# EasyEDA Pro project Smart-ePaper-TestBoard.eprj

# Schematic Schematic1
Board Name: Board1; Create Date: 2024-09-18; Company: TLLWTG; Drawed: TLLWTG; Reviewed: TLLWTG
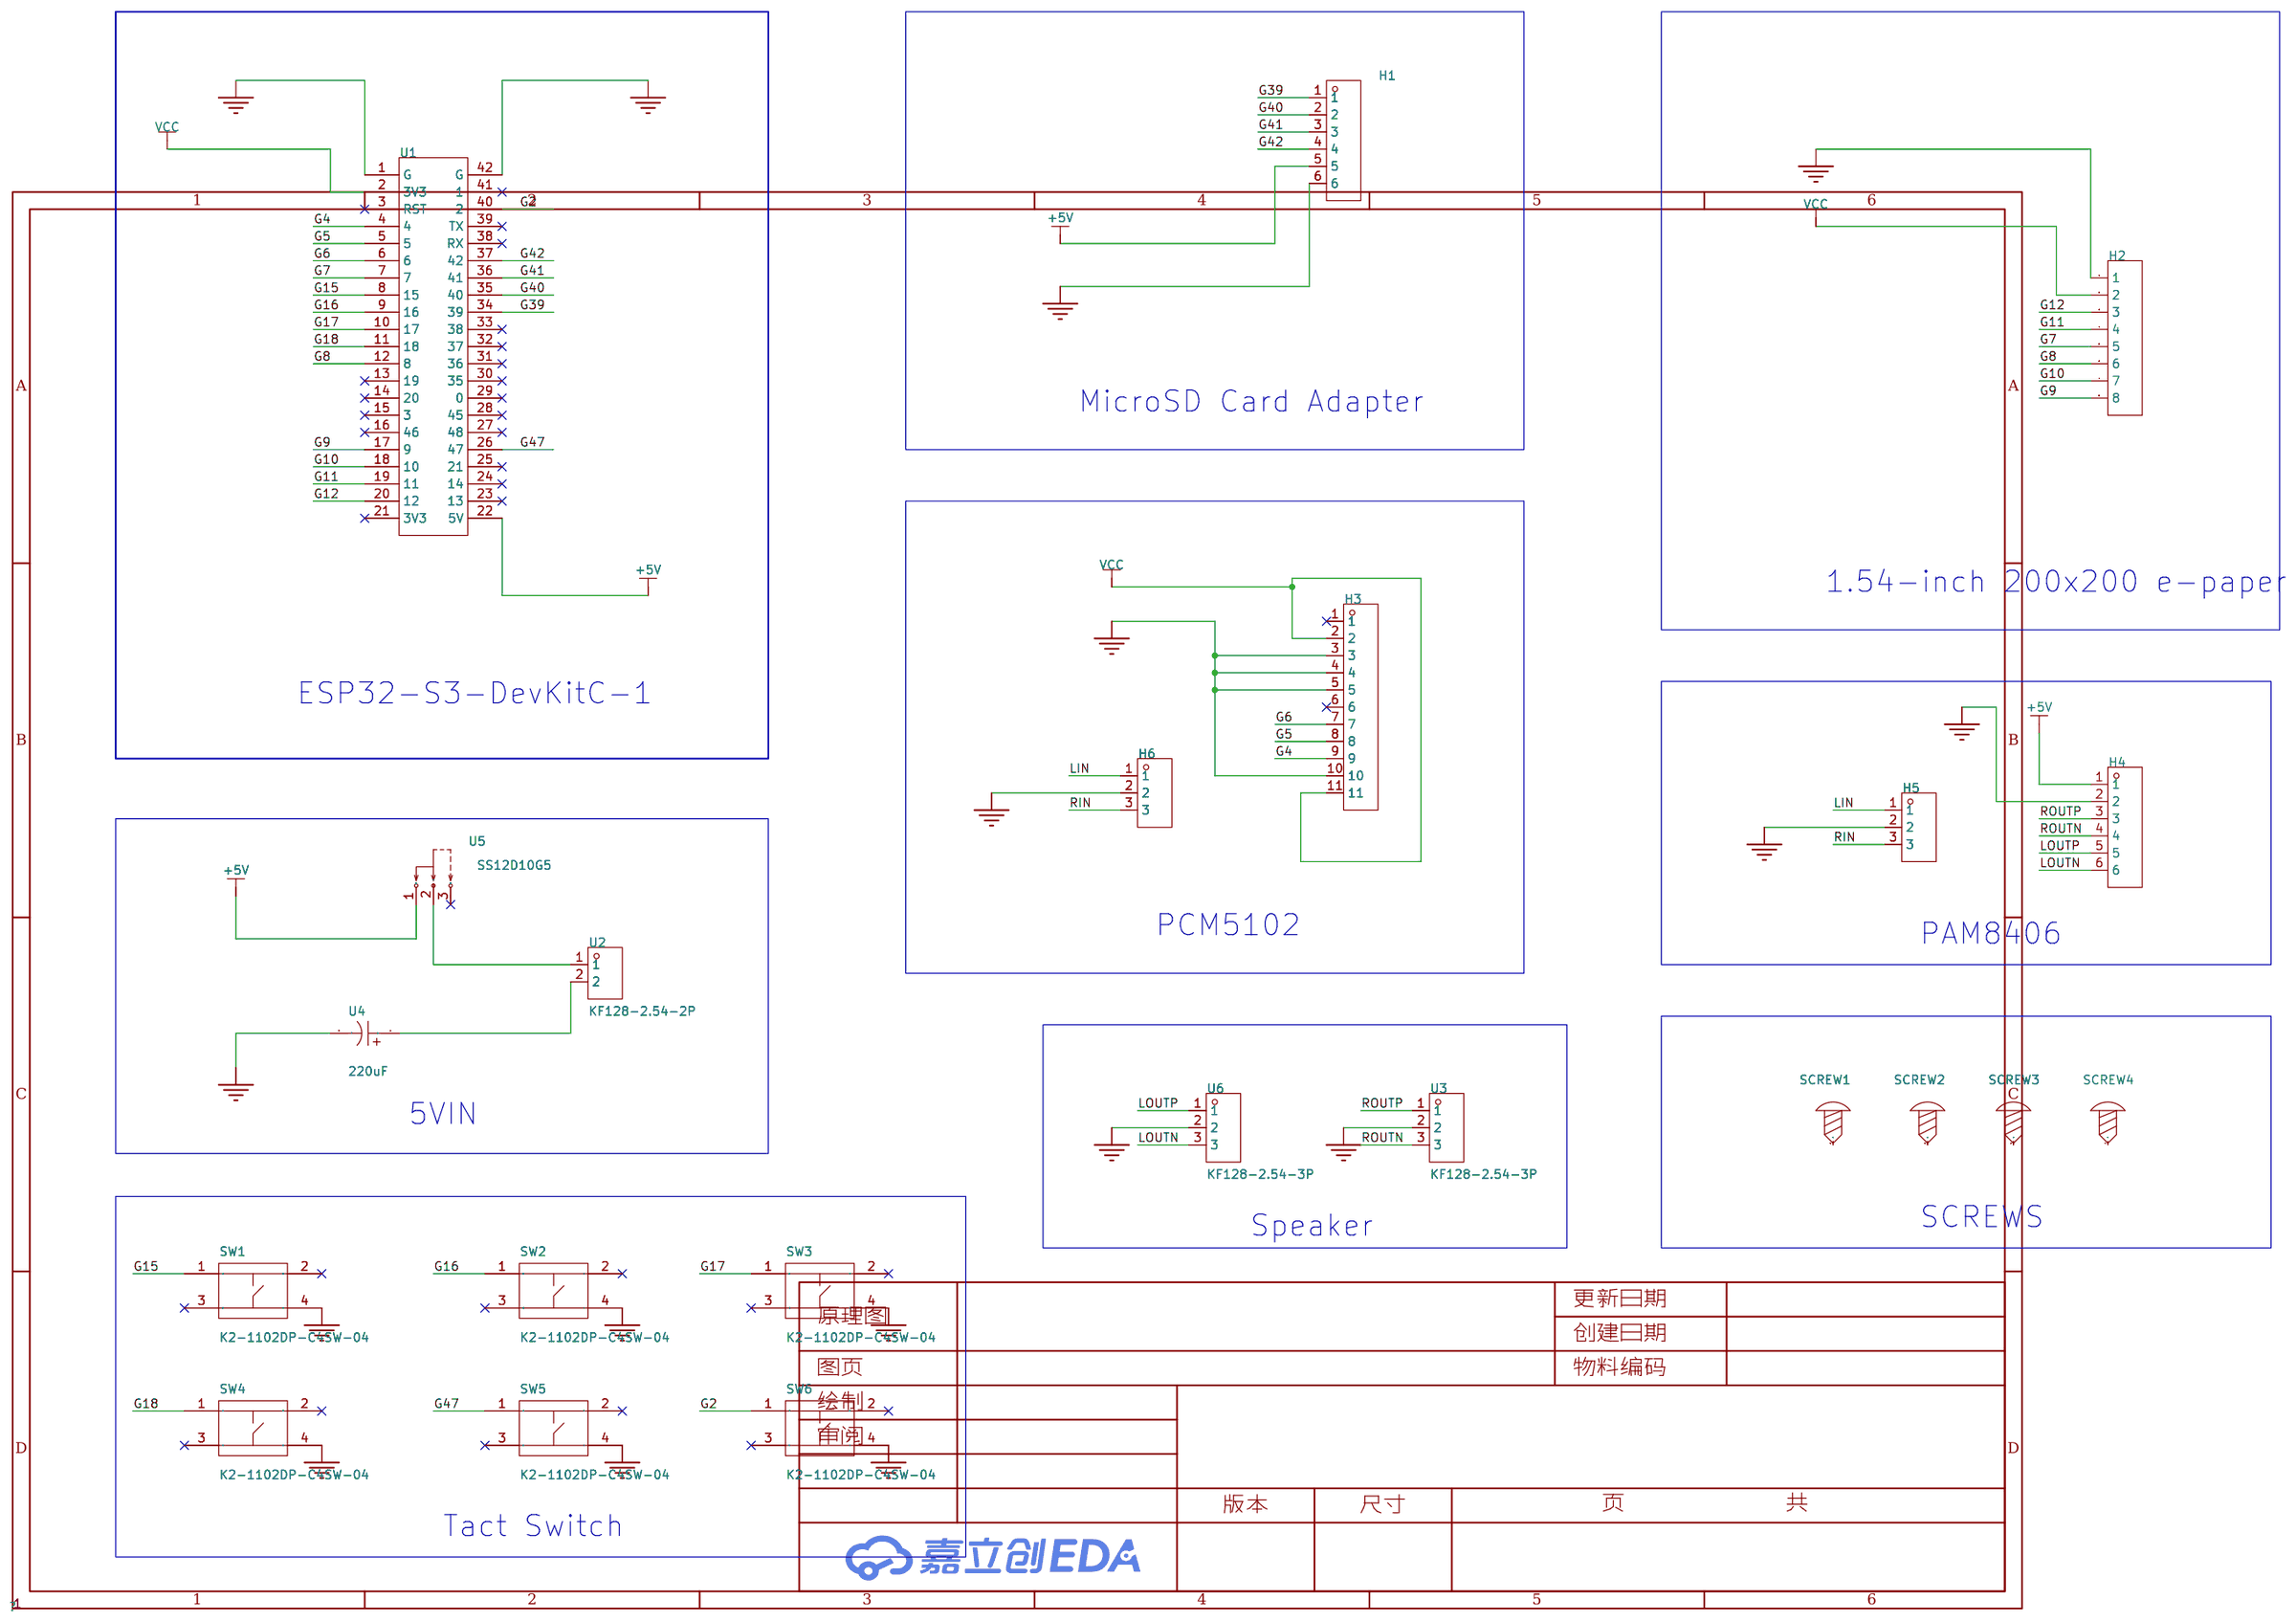
[diagram p0: schematic sheet]

## Parts
H1  -  [HDR-TH_6P-P2.54-V-F]
H2  -  [HDR-TH_8P-P2.54-V-F-1]
H3  -  [HDR-TH_11P-P2.54-V-F]
H4  -  [HDR-TH_6P-P2.54-V-F]
H5  -  [HDR-TH_3P-P2.54-V-F]
H6  -  [HDR-TH_3P-P2.54-V-F]
SCREW1  -  [M3螺丝]
SCREW2  -  [M3螺丝]
SCREW3  -  [M3螺丝]
SCREW4  -  [M3螺丝]
SW1  K2-1102DP-C4SW-04  [KEY-TH_4P-L6.0-W6.0-P4.50-LS6.50]
SW2  K2-1102DP-C4SW-04  [KEY-TH_4P-L6.0-W6.0-P4.50-LS6.50]
SW3  K2-1102DP-C4SW-04  [KEY-TH_4P-L6.0-W6.0-P4.50-LS6.50]
SW4  K2-1102DP-C4SW-04  [KEY-TH_4P-L6.0-W6.0-P4.50-LS6.50]
SW5  K2-1102DP-C4SW-04  [KEY-TH_4P-L6.0-W6.0-P4.50-LS6.50]
SW6  K2-1102DP-C4SW-04  [KEY-TH_4P-L6.0-W6.0-P4.50-LS6.50]
U1  -  [ESP32-S3-DevKitC-1]
U2  KF128-2.54-2P  [CONN-TH_P2.54_KF128-2.54-2P]
U3  KF128-2.54-3P  [CONN-TH_3P-P2.54_KF128-2.54-3P]
U4  220uF  [CAP-TH_BD6.3-P2.50-D0.5-FD]
U5  SS12D10G5  [SW-TH_SHOU-HAN_SS12D10G4]
U6  KF128-2.54-3P  [CONN-TH_3P-P2.54_KF128-2.54-3P]

## Library data of the parts
H1 H4 = HDR-F_2.54_1x6P: Supplier Part: C40877; Supplier Footprint: 插件
H2 = HDR-F_2.54_1x8P: Supplier Part: C27438; Supplier Footprint: 插件
H3 = HDR-F_2.54_1x11P: Supplier Part: C2897374; Supplier Footprint: 插件
H5 H6 = HDR-F_2.54_1x3P: Supplier Part: C541850; Supplier Footprint: 插件
SCREW1-SCREW4 = M3螺丝: Supplier Footprint: 插件
SW1-SW6 = K2-1102DP-C4SW-04: LCSC Part Name: 轻触按键开关6*6*5; Supplier Part: C110153; Manufacturer: 韩国韩荣; Supplier Footprint: 插件; JLCPCB Part Class: 扩展库; Datasheet: https://atta.szlcsc.com/upload/public/pdf/source/20210810/D0CD9D77408EACA829A5E533AC6E5B1E.pdf; Supplier: LCSC; Circuit: 单刀单掷; Actuator Style: 圆形按钮; Operating Force: 2.5N; Mounting Style: 直插; Switch Length: 6mm; Switch Width: 6mm; Switch Height: 5mm; Contact Current: 50mA; Voltage Rating (DC): 12V; Insulation Resistance: 100MΩ; Mechanical Life: 10万次; Operating Temperature: -25℃~+85℃
U1 = ESP32-S3-DevKitC-1
U2 = KF128-2.54-2P: LCSC Part Name: 2.54mm 1x2P 排数:1 每排P数:2 直插; Supplier Part: C474920; Manufacturer: KEFA(科发); Supplier Footprint: 插件,P=2.54mm; JLCPCB Part Class: 扩展库; Datasheet: https://atta.szlcsc.com/upload/public/pdf/source/20230317/0E5ECA9DB49110BC3219D12632CEA6EE.pdf; Supplier: LCSC; Structure: 1x2P; Pitch: 2.54mm; Color: 绿色; Mounting Style: 直插; Current Rating (Max): 8A; Voltage Rating (Max): 130V; Number of Pins: 2P; Number of Rows: 1; Wire Gauge - AWG: 18~26; Wire Gauge - mm2: 1; Number of PINs Per Row: 2; Operating Temperature Range: -40℃~+105℃
U3 U6 = KF128-2.54-3P: LCSC Part Name: 2.54mm 1x3P 排数:1 每排P数:3 直插; Supplier Part: C474921; Manufacturer: KEFA(科发); Supplier Footprint: 插件,P=2.54mm; JLCPCB Part Class: 扩展库; Datasheet: https://atta.szlcsc.com/upload/public/pdf/source/20230317/0E5ECA9DB49110BC3219D12632CEA6EE.pdf; Supplier: LCSC; Structure: 1x3P; Pitch: 2.54mm; Color: 绿色; Mounting Style: 直插; Current Rating (Max): 8A; Voltage Rating (Max): 130V; Number of Pins: 3P; Number of Rows: 1; Wire Gauge - AWG: 18~26; Wire Gauge - mm2: 1; Number of PINs Per Row: 3; Operating Temperature Range: -40℃~+105℃
U4 = KM1E221M0611: LCSC Part Name: 220uF ±20% 25V; Supplier Part: C2873972; Manufacturer: ROQANG(容强); Supplier Footprint: 插件; JLCPCB Part Class: 扩展库; Datasheet: https://atta.szlcsc.com/upload/public/pdf/source/20210825/43CC5C3A3C9845108B639C21E16A1224.pdf; Supplier: LCSC; Tolerance: ±20%; Rated Voltage: 25V; Ripple Current: 236mA@120kHz; Lead Spacing: 2.5mm; Lifetime @ Temp: 2000hrs@105℃; Operating Temperature: -40℃~+105℃
U5 = SS12D10G5: LCSC Part Name: 两档立式插件 3脚拨动开关 柄长5.0mm; Supplier Part: C7431054; Manufacturer: SHOU HAN(首韩); Supplier Footprint: 插件; JLCPCB Part Class: 扩展库; Datasheet: https://atta.szlcsc.com/upload/public/pdf/source/20231130/7A3DB6A149BF0A1DCFFE64FFC07FE434.pdf; Supplier: LCSC; Circuit: 单刀双掷; Switch Length: 12.7mm; Switch Width: 6.7mm; Mounting Style: 直插; Current Rating (DC): 2A; Voltage Rating (DC): 125V; Mechanical Life: 3千次; Operating Temperature: -25℃~+70℃

## Nets
+5V: H1.5 H4.1 U1.22(5V) U5.1
GND: H1.6 H2.1 H3.3 H3.4 H3.5 H3.10 H4.2 H5.2 H6.2 SW1.4 SW2.4 SW3.4 SW4.4 SW5.4 SW6.4 U1.1(G) U1.42(G) U3.2 U4.2 U6.2
VCC: H2.2 H3.2 H3.11 U1.2(3V3)
G2: SW6.1 U1.40(2)
G4: H3.9 U1.4
G5: H3.8 U1.5
G6: H3.7 U1.6
G7: H2.5 U1.7
G8: H2.6 U1.12(8)
G9: H2.8 U1.17(9)
G10: H2.7 U1.18(10)
G11: H2.4 U1.19(11)
G12: H2.3 U1.20(12)
G15: SW1.1 U1.8(15)
G16: SW2.1 U1.9(16)
G17: SW3.1 U1.10(17)
G18: SW4.1 U1.11(18)
G39: H1.1 U1.34(39)
G40: H1.2 U1.35(40)
G41: H1.3 U1.36(41)
G42: H1.4 U1.37(42)
G47: SW5.1 U1.26(47)
LIN: H5.1 H6.1
LOUTN: H4.6 U6.3
LOUTP: H4.5 U6.1
RIN: H5.3 H6.3
ROUTN: H4.4 U3.3
ROUTP: H4.3 U3.1
$1N2712: U2.2 U4.1
$1N2746: U2.1 U5.2

Not connected (* = marked no-connect by the designer): H3 1* 6*; SCREW1 1; SCREW2 1; SCREW3 1; SCREW4 1; SW1 2* 3*; SW2 2* 3*; SW3 2* 3*; SW4 2* 3*; SW5 2* 3*; SW6 2* 3*; U1 3(RST)* 13(19)* 14(20)* 15(3)* 16(46)* 21(3V3)* 23(13)* 24(14)* 25(21)* 27(48)* 28(45)* 29(0)* 30(35)* 31(36)* 32(37)* 33(38)* 38(RX)* 39(TX)* 41(1)*; U5 3*

## Notes on the sheet
- MicroSD Card Adapter
- 1.54-inch 200x200 e-paper
- ESP32-S3-DevKitC-1
- PCM5102
- PAM8406
- 5VIN
- SCREWS
- Speaker
- Tact Switch

# Board PCB1
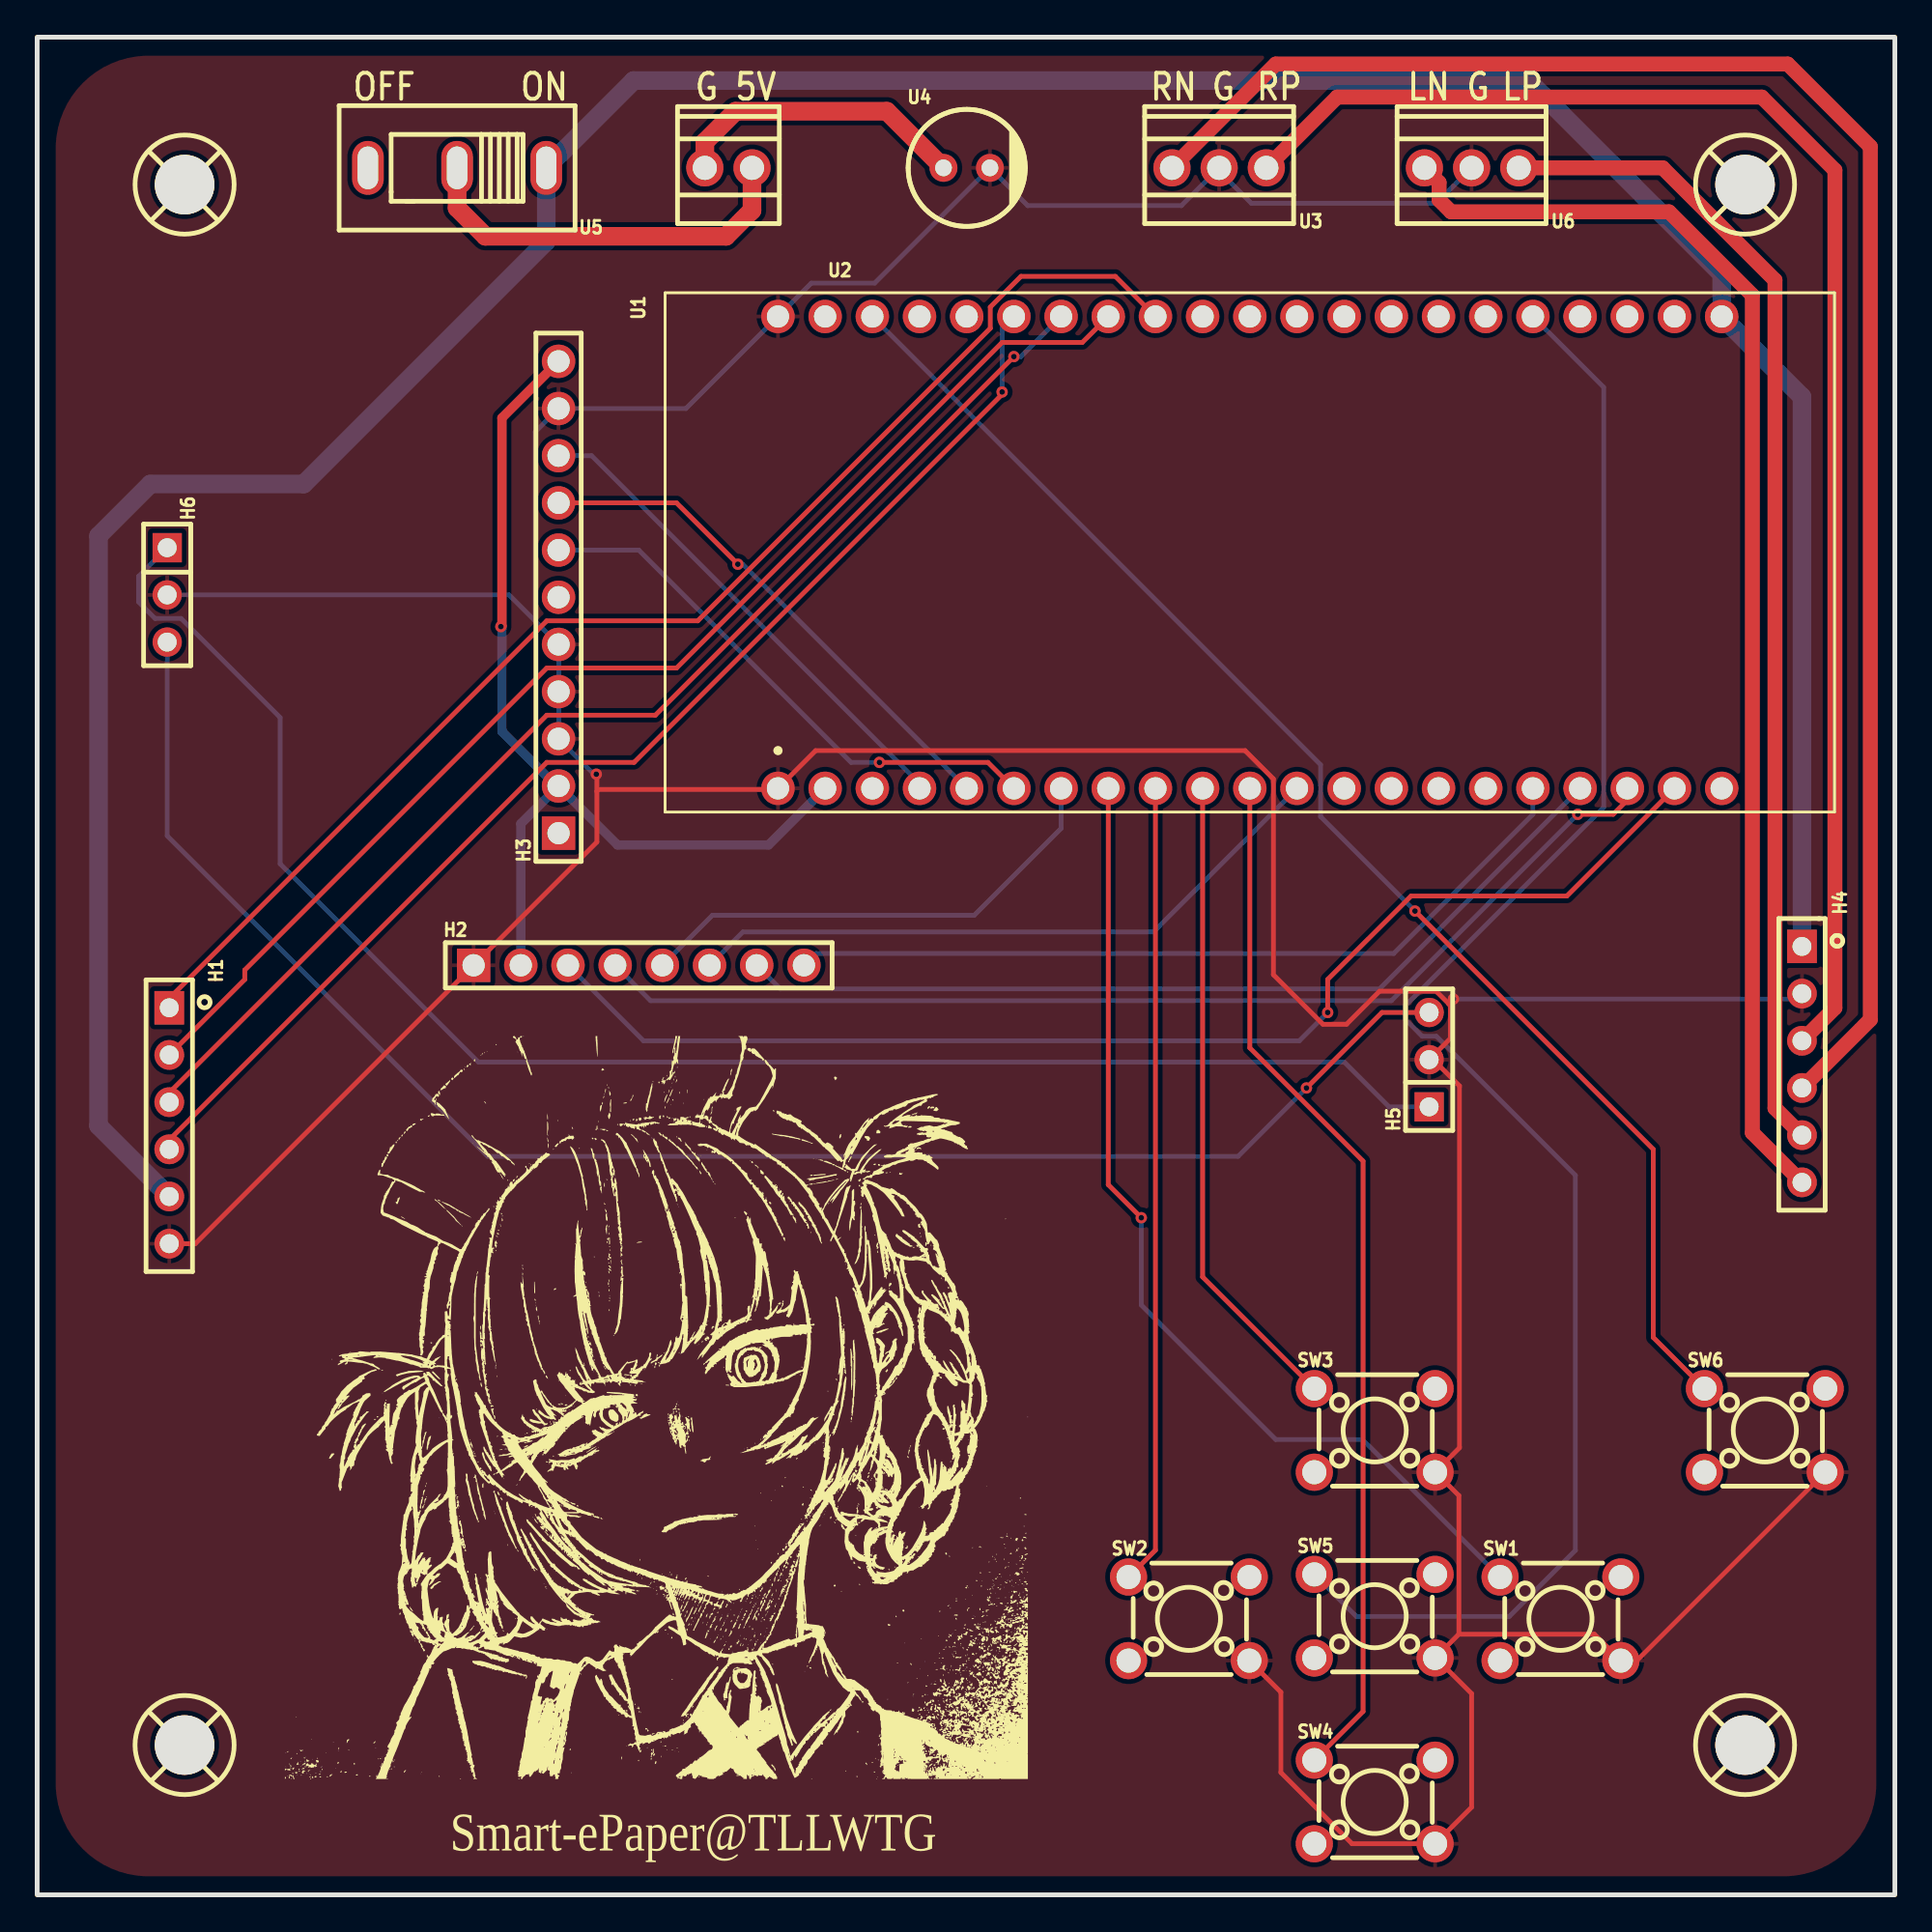
[diagram p1: board, top side]
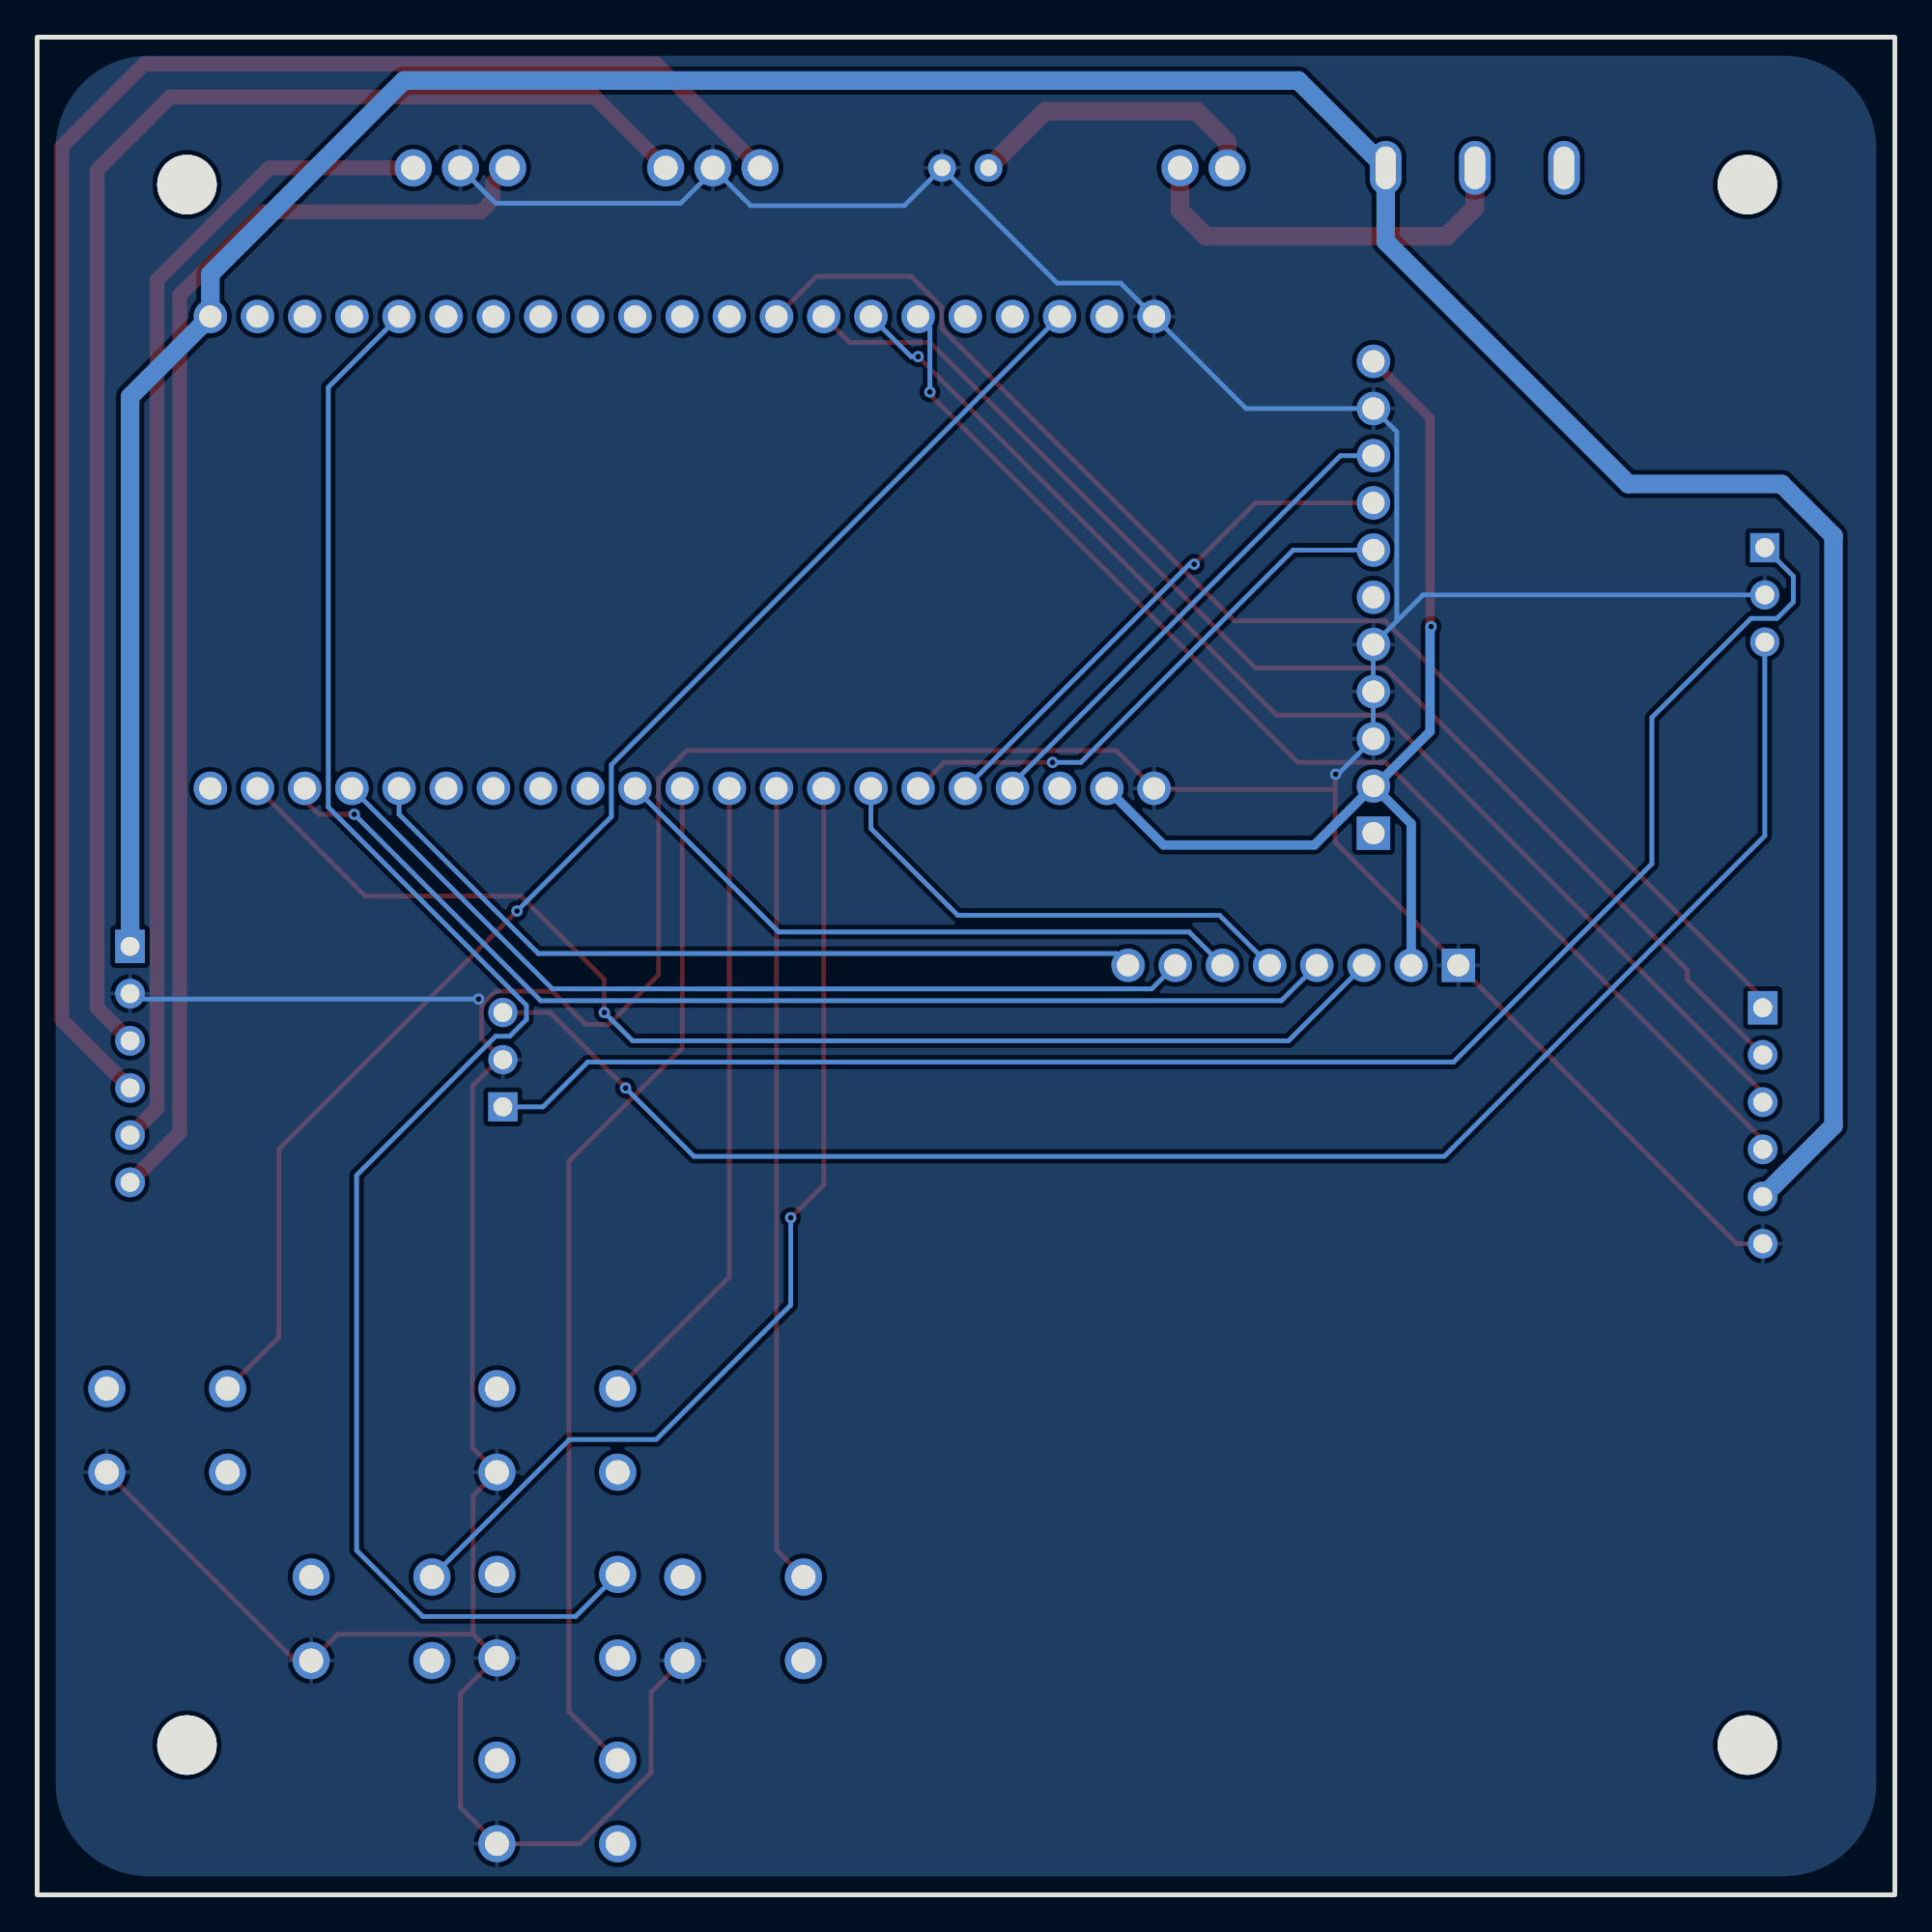
[diagram p2: board, bottom side, seen from below]

Outline 100 x 100 mm; copper layers: Top Layer, Bottom Layer. Coordinates in mm from the lower left corner of the outline.
Outline path: rectangle 0,100 100,0
Stack: Top Layer 0.035mm / Dielectric1 1.51mm FR4 er 4.5 / Bottom Layer 0.035mm

## Design rules (mm)
template: JLCPCB Capability(Two Layers Board)
spacing copperThickness1oz (default): track to track 0.102, other pairs 0.152 to 0.3
spacing copperThickness2oz: track to track 0.203, other pairs 0.152 to 0.3
track width copperThickness1oz (default): min 0.127, default 0.254, max 2.54
track width copperThickness2oz: min 0.203, default 0.254, max 2.54
differential pair differentialPair (default): width min 0.127, default 0.254, max 2.54; gap min 0.152, default 0.152
via viaSize (default): diameter min 0.5, default 0.61, max 10; hole min 0.3, default 0.305, max 6.3

## Placement (name value [footprint] x y rotation side)
H1  -  [HDR-TH_6P-P2.54-V-F]  7.11 41.4 270 top
H2  -  [HDR-TH_8P-P2.54-V-F-1]  32.38 50.04 0 top
H3  -  [HDR-TH_11P-P2.54-V-F]  28.07 69.85 90 top
H4  -  [HDR-TH_6P-P2.54-V-F]  95 44.7 270 top
H5  -  [HDR-TH_3P-P2.54-V-F]  74.93 44.96 90 top
H6  -  [HDR-TH_3P-P2.54-V-F]  7 69.98 270 top
SCREW1  -  [M3螺丝]  8 92 0 top
SCREW2  -  [M3螺丝]  92 92 0 top
SCREW3  -  [M3螺丝]  92 8 0 top
SCREW4  -  [M3螺丝]  8 8 0 top
SW1  K2-1102DP-C4SW-04  [KEY-TH_4P-L6.0-W6.0-P4.50-LS6.50]  82 14.86 0 top
SW2  K2-1102DP-C4SW-04  [KEY-TH_4P-L6.0-W6.0-P4.50-LS6.50]  62 14.86 0 top
SW3  K2-1102DP-C4SW-04  [KEY-TH_4P-L6.0-W6.0-P4.50-LS6.50]  72 25 0 top
SW4  K2-1102DP-C4SW-04  [KEY-TH_4P-L6.0-W6.0-P4.50-LS6.50]  72 5 0 top
SW5  K2-1102DP-C4SW-04  [KEY-TH_4P-L6.0-W6.0-P4.50-LS6.50]  72 15 0 top
SW6  K2-1102DP-C4SW-04  [KEY-TH_4P-L6.0-W6.0-P4.50-LS6.50]  93 25 0 top
U1  -  [ESP32-S3-DevKitC-1]  65.28 72.26 90 top
U2  KF128-2.54-2P  [CONN-TH_P2.54_KF128-2.54-2P]  37.21 92.96 180 top
U3  KF128-2.54-3P  [CONN-TH_3P-P2.54_KF128-2.54-3P]  63.63 92.96 180 top
U4  220uF  [CAP-TH_BD6.3-P2.50-D0.5-FD]  50.04 92.96 0 top
U5  SS12D10G5  [SW-TH_SHOU-HAN_SS12D10G4]  22.61 92.96 180 top
U6  KF128-2.54-3P  [CONN-TH_3P-P2.54_KF128-2.54-3P]  77.22 92.96 180 top

## Footprints (pads in the part's own frame, mm; a bottom-side part is the same pattern mirrored in y, then rotated)
CAP-TH_BD6.3-P2.50-D0.5-FD
  round 1.5 hole 0.9: 1(-1.25,0) 2(1.25,0)
CONN-TH_3P-P2.54_KF128-2.54-3P
  round 2 hole 1.3: 1(-2.54,0) 2(0,0) 3(2.54,0)
CONN-TH_P2.54_KF128-2.54-2P
  round 2 hole 1.3: 1(-1.27,0) 2(1.27,0)
ESP32-S3-DevKitC-1
  round 1.8 hole 1.2: 1(-12.7,25.4) 2(-12.7,22.86) 3(-12.7,20.32) 4(-12.7,17.78) 5(-12.7,15.24) 6(-12.7,12.7) 7(-12.7,10.16) 8(-12.7,7.62) 9(-12.7,5.08) 10(-12.7,2.54) 11(-12.7,0) 12(-12.7,-2.54) 13(-12.7,-5.08) 14(-12.7,-7.62) 15(-12.7,-10.16) 16(-12.7,-12.7) 17(-12.7,-15.24) 18(-12.7,-17.78) 19(-12.7,-20.32) 20(-12.7,-22.86) 21(-12.7,-25.4) 22(12.7,-25.4) 23(12.7,-22.86) 24(12.7,-20.32) 25(12.7,-17.78) 26(12.7,-15.24) 27(12.7,-12.7) 28(12.7,-10.16) 29(12.7,-7.62) 30(12.7,-5.08) 31(12.7,-2.54) 32(12.7,0) 33(12.7,2.54) 34(12.7,5.08) 35(12.7,7.62) 36(12.7,10.16) 37(12.7,12.7) 38(12.7,15.24) 39(12.7,17.78) 40(12.7,20.32) 41(12.7,22.86) 42(12.7,25.4)
HDR-TH_3P-P2.54-V-F
  rect 1.575x1.575 hole 1.02: 1(-2.54,0)
  round 1.575 hole 1.02: 2(0,0) 3(2.54,0)
HDR-TH_6P-P2.54-V-F
  rect 1.8x1.6 hole 1.02: 1(-6.35,0)
  round 1.6 hole 1.02: 2(-3.81,0) 3(-1.27,0) 4(1.27,0) 5(3.81,0) 6(6.35,0)
HDR-TH_8P-P2.54-V-F-1
  rect 1.8x1.8 hole 1.2: 1(-8.89,0)
  round 1.8 hole 1.2: 2(-6.35,0) 3(-3.81,0) 4(-1.27,0) 5(1.27,0) 6(3.81,0) 7(6.35,0) 8(8.89,0)
HDR-TH_11P-P2.54-V-F
  rect 1.8x1.8 hole 1.2: 1(-12.7,0)
  round 1.8 hole 1.2: 2(-10.16,0) 3(-7.62,0) 4(-5.08,0) 5(-2.54,0) 6(0,0) 7(2.54,0) 8(5.08,0) 9(7.62,0) 10(10.16,0) 11(12.7,0)
KEY-TH_4P-L6.0-W6.0-P4.50-LS6.50
  round 2 hole 1.3: 1(-3.25,2.25) 2(3.25,2.25) 3(-3.25,-2.25) 4(3.25,-2.25)
M3螺丝
  round 3.2 hole 3.2: 1(-0.064,0.064)
SW-TH_SHOU-HAN_SS12D10G4
  oval 1.7x2.9 hole 1.1x2.3: 1(-4.8,0) 2(0,0) 3(4.8,0)

## Nets
As in the schematic.

Pads without a net: H3 1 6; SCREW1 1; SCREW2 1; SCREW3 1; SCREW4 1; SW1 2 3; SW2 2 3; SW3 2 3; SW4 2 3; SW5 2 3; SW6 2 3; U1 3 13 14 15 16 21 23 24 25 27 28 29 30 31 32 33 38 39 41; U5 3

## Via types
v1: diameter 0.61, hole 0.305, Top Layer to Bottom Layer, 12 vias

## Routing (per net, layer and track width the routed paths; a pad name or vN(x,y) marks a point on that pad's centre or on a via; arc(x,y) is an arc through that point)
+5V: length 179.3
  Bottom Layer w1: H4.1 95,80.64 U1.22 90.68,87.25 80.26,97.66 32.1,97.66 U5.1 27.41,89 14.35,75.95 6.1,75.95 3.3,73.15 3.3,41.4 H1.5
GND: length 305.7
  Top Layer w0.254: 76.53,14.03 75.28,12.78 ; 76.53,14.03 76.53,21.49 75.26,22.76 ; 76.53,14.03 83.83,14.03 SW1.4 86.11,12.61 SW6.4 ; 75.28,12.78 SW5.4 ; 75.28,12.78 77.22,10.83 77.22,4.72 SW4.4 70.78,2.75 66.95,6.58 66.95,10.91 SW2.4 ; v1(30.1,60.33) 30.13,60.29 30.13,59.4 ; 75.04,45.07 76.56,43.54 76.56,24.06 75.26,22.76 ; 75.04,45.07 76.07,46.1 76.07,47.88 75.98,47.97 ; 75.04,45.07 H5.2 ; 75.98,47.97 v1(76.24,48.22) ; 75.98,47.97 75.31,48.64 72.26,48.64 70.49,46.86 69.22,46.86 66.55,49.53 66.55,60.07 65.02,61.59 41.91,61.59 U1.1 39.81,59.5 30.23,59.5 30.13,59.4 ; 75.26,22.76 SW3.4 ; 30.13,59.4 30.13,56.67 8.51,35.05 H1.6
  Bottom Layer w0.254: 26.81,68.57 H3.5 28.08,67.3 28.08,64.76 ; 26.81,68.57 25.4,69.98 H6.2 ; 26.81,68.57 26.81,78.75 H3.10 34.93,80.01 U1.42 41.67,86.76 45.08,86.76 U4.2 53.32,90.93 61.59,90.93 63.54,92.88 ; 28.08,64.76 H3.4 ; 28.08,64.76 28.08,62.22 ; v1(76.24,48.22) 94.71,48.22 H4.2 ; 63.54,92.88 65.36,91.06 75.31,91.06 U6.2 ; 63.54,92.88 U3.2 ; 28.08,62.22 29.97,60.33 v1(30.1,60.33) ; 28.08,62.22 H3.3
VCC: length 52.9
  Top Layer w0.5: v1(24.96,68.27) 25.02,68.33 25.02,79.5 H3.11
  Bottom Layer w0.254: 28.01,59.63 H3.2 ; 42.37,59.51 U1.2
  Bottom Layer w0.5: v1(24.96,68.27) 25.02,68.21 25.02,62.63 28.01,59.63 26.03,57.66 H2.2 ; 42.37,59.51 39.37,56.52 31.24,56.52 H3.2
G2: length 76.3
  Top Layer w0.254: SW6.1 87,30 87,40.13 v1(74.17,52.96)
  Bottom Layer w0.254: v1(74.17,52.96) 69.09,58.04 69.09,60.83 U1.40
G4: length 27
  Bottom Layer w0.254: H3.9 29.84,77.47 47.5,59.82 U1.4
G5: length 28.3
  Top Layer w0.254: v1(37.72,71.63) 34.42,74.93 H3.8
  Bottom Layer w0.254: v1(37.72,71.63) 37.97,71.63 U1.5
G6: length 29.8
  Top Layer w0.254: v1(45.34,60.96) 51.18,60.96 U1.6
  Bottom Layer w0.254: H3.7 32.38,72.39 43.81,60.96 v1(45.34,60.96)
G7: length 26.7
  Bottom Layer w0.254: U1.7 55.12,57.4 50.45,52.73 36.35,52.73 H2.5
G8: length 35.6
  Bottom Layer w0.254: H2.6 37.99,51.83 60.09,51.83 U1.12
G9: length 44
  Bottom Layer w0.254: U1.17 80.52,58.17 73.03,50.67 41.91,50.67 41.28,50.04
G10: length 49.3
  Bottom Layer w0.254: 38.74,50.04 40,48.77 72.26,48.77 U1.18
G11: length 60.4
  Top Layer w0.254: v1(82.93,58.17) 84.84,58.17 85.6,58.93 U1.19
  Bottom Layer w0.254: 31.12,50.04 33.02,48.13 72.9,48.13 v1(82.93,58.17)
G12: length 67.9
  Top Layer w0.254: U1.20 82.34,53.77 73.96,53.77 69.47,49.28 v1(69.47,47.5)
  Bottom Layer w0.254: H2.3 32.64,45.97 67.94,45.97 v1(69.47,47.5)
G15: length 53.9
  Top Layer w0.254: U1.8 57.66,38.23 v1(59.44,36.45)
  Bottom Layer w0.254: SW1.1 71.35,24.51 66.68,24.51 59.44,31.75 v1(59.44,36.45)
G16: length 43.1
  Top Layer w0.254: U1.9 60.2,18.56 SW2.1
G17: length 34.8
  Top Layer w0.254: SW3.1 62.74,33.26 U1.10
G18: length 55.9
  Top Layer w0.254: U1.11 65.28,45.59 71.37,39.5 71.37,9.87 SW4.1
G39: length 71.3
  Top Layer w0.254: U1.34 58.04,87.12 52.96,87.12 51.31,85.47 51.31,84.33 35.56,68.58 27.43,68.58 7.11,48.26 H1.1
G40: length 67.3
  Top Layer w0.254: U1.35 56.26,83.57 51.94,83.57 34.42,66.04 27.43,66.04 11.18,49.78 11.18,49.28 H1.2
G41: length 65.8
  Top Layer w0.254: v1(52.58,82.8) 33.27,63.5 27.43,63.5 7.11,43.18 H1.3
  Bottom Layer w0.254: U1.36 52.96,82.8 v1(52.58,82.8)
G42: length 66.4
  Top Layer w0.254: H1.4 7.11,40.64 27.43,60.96 32.13,60.96 51.94,80.77 v1(51.94,80.9)
  Bottom Layer w0.254: U1.37 51.94,84.33 v1(51.94,80.9)
G47: length 93.1
  Bottom Layer w0.254: SW5.1 71.01,14.99 79.25,14.99 82.8,18.54 82.8,38.73 75.32,46.22 74.56,46.22 73.66,47.12 73.66,47.88 84.33,58.55 84.33,81.15 U1.26
LIN: length 88.9
  Bottom Layer w0.254: H5.1 72.77,42.42 70.36,44.83 23.75,44.83 13.08,55.5 13.08,63.37 7.75,68.71 6.35,68.71 5.46,69.6 5.46,70.98 7,72.52
LOUTN: length 69.9
  Top Layer w0.8: H4.6 92.33,41.03 92.33,86.11 87.84,90.6 76.11,90.6 75.47,91.25 75.47,92.17 U6.3
LOUTP: length 62.9
  Top Layer w0.8: U6.1 87.5,92.96 93.55,86.92 93.55,42.35 H4.5
RIN: length 88.7
  Top Layer w0.254: v1(68.33,43.43) 72.39,47.5 H5.3
  Bottom Layer w0.254: H6.3 7,57.01 24.26,39.75 64.64,39.75 v1(68.33,43.43)
ROUTN: length 93.9
  Top Layer w0.8: H4.4 98.68,47.11 98.68,94.11 94.23,98.55 66.68,98.55 U3.3
ROUTP: length 81.4
  Top Layer w0.8: H4.3 96.77,47.75 96.77,92.84 92.84,96.77 69.98,96.77 U3.1
$1N2712: length 16.2
  Top Layer w1: U4.1 45.74,96.01 37.59,96.01 35.94,94.36 U2.2
$1N2746: length 21.5
  Top Layer w1: 38.48,92.96 38.48,90.68 37.08,89.28 24.13,89.28 22.61,90.81 U5.2

## Copper pours and planes (outline as drawn; the poured copper is in the pictures)
GND on Top Layer: 1,94 1.01,94.34 1.06,94.78 1.15,95.22 1.28,95.65 1.45,96.07 1.65,96.47 1.89,96.85 2.16,97.2 2.46,97.54 2.8,97.84 3.15,98.11 3.53,98.35 3.93,98.55 4.35,98.72 4.78,98.85 5.22,98.94 5.66,98.99 6,99 94,99 94.34,98.99 94.78,98.94 95.22,98.85 95.65,98.72 96.07,98.55 96.47,98.35 96.85,98.11 97.2,97.84 97.54,97.54 97.84,97.2 98.11,96.85 98.35,96.47 98.55,96.07 98.72,95.65 98.85,95.22 98.94,94.78 98.99,94.34 99,94 99,6 98.99,5.66 98.94,5.22 98.85,4.78 98.72,4.35 98.55,3.93 98.35,3.53 98.11,3.15 97.84,2.8 97.54,2.46 97.2,2.16 96.85,1.89 96.47,1.65 96.07,1.45 95.65,1.28 95.22,1.15 94.78,1.06 94.34,1.01 94,1 6,1 5.66,1.01 5.22,1.06 4.78,1.15 4.35,1.28 3.93,1.45 3.53,1.65 3.15,1.89 2.8,2.16 2.46,2.46 2.16,2.8 1.89,3.15 1.65,3.53 1.45,3.93 1.28,4.35 1.15,4.78 1.06,5.22 1.01,5.66 1,6
GND on Bottom Layer: 1,94 1.01,94.34 1.06,94.78 1.15,95.22 1.28,95.65 1.45,96.07 1.65,96.47 1.89,96.85 2.16,97.2 2.46,97.54 2.8,97.84 3.15,98.11 3.53,98.35 3.93,98.55 4.35,98.72 4.78,98.85 5.22,98.94 5.66,98.99 6,99 94,99 94.34,98.99 94.78,98.94 95.22,98.85 95.65,98.72 96.07,98.55 96.47,98.35 96.85,98.11 97.2,97.84 97.54,97.54 97.84,97.2 98.11,96.85 98.35,96.47 98.55,96.07 98.72,95.65 98.85,95.22 98.94,94.78 98.99,94.34 99,94 99,6 98.99,5.66 98.94,5.22 98.85,4.78 98.72,4.35 98.55,3.93 98.35,3.53 98.11,3.15 97.84,2.8 97.54,2.46 97.2,2.16 96.85,1.89 96.47,1.65 96.07,1.45 95.65,1.28 95.22,1.15 94.78,1.06 94.34,1.01 94,1 6,1 5.66,1.01 5.22,1.06 4.78,1.15 4.35,1.28 3.93,1.45 3.53,1.65 3.15,1.89 2.8,2.16 2.46,2.46 2.16,2.8 1.89,3.15 1.65,3.53 1.45,3.93 1.28,4.35 1.15,4.78 1.06,5.22 1.01,5.66 1,6

## Text on the board
Top Silkscreen Layer: OFF | ON | G | 5V | RN | RP | LN | LP | Smart-ePaper@TLLWTG
